# EAGLE design pot-boardB (EAGLE 6.6.0)
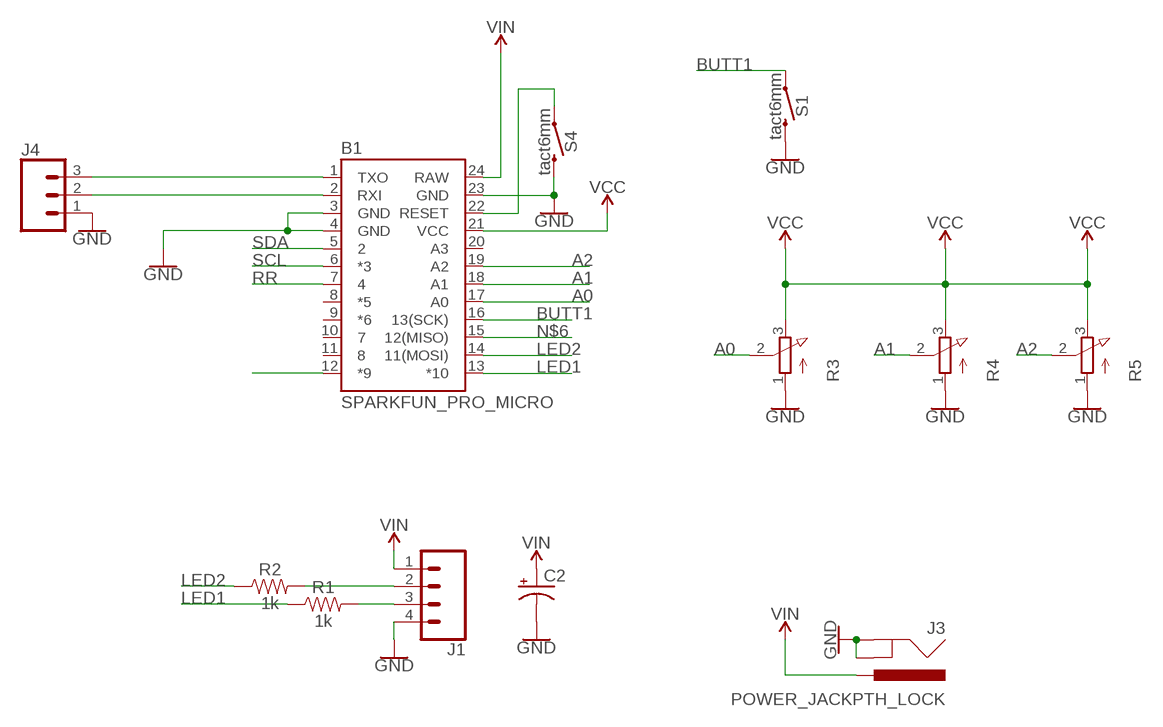
[diagram p0: schematic, sheet 1]

## Parts
B1  SPARKFUN_PRO_MICRO  [SPARKFUN_PRO_MICRO]
C2  CPOL-USE3.5-8  [E3,5-8]
J1  CONN_04  [1X04]
J3  POWER_JACKPTH_LOCK  [POWER_JACK_PTH_LOCK]
J4  CONN_03  [1X03]
R1  1k  1KOHM-HORIZ-1/4W-5%  [AXIAL-0.3]
R2  1k  1KOHM-HORIZ-1/4W-5%  [AXIAL-0.3]
R3  3RP/1610N  [3RP/1610N]
R4  3RP/1610N  [3RP/1610N]
R5  3RP/1610N  [3RP/1610N]
S1  tact6mm  MOMENTARY-SWITCH-SPST-PTH-6.0MM  [TACTILE_SWITCH_PTH_6.0MM]
S4  tact6mm  MOMENTARY-SWITCH-SPST-PTH-6.0MM  [TACTILE_SWITCH_PTH_6.0MM]

## Nets
A0: B1.17(A0) R3.2(S)
A1: B1.18(A1) R4.2(S)
A2: B1.19(A2) R5.2(S)
BUTT1: B1.16(13(SCK)) S1.1
GND: B1.3(GND) B1.4(GND) B1.23(GND) C2.- J1.4 J3.GND J3.GNDBREAK J4.1 R3.1(A) R4.1(A) R5.1(A) S1.3 S4.3
LED1: B1.13(*10) R1.P$1
LED2: B1.14(11(MOSI)) R2.P$1
N$1: J1.3 R1.P$2
N$2: J1.2 R2.P$2
N$3: B1.2(RXI) J4.2
N$4: B1.1(TXO) J4.3
N$5: B1.12(*9)
N$6: B1.15(12(MISO))
RESET: B1.22(RESET) S4.1
RR: B1.7
SCL: B1.6(*3)
SDA: B1.5
VCC: B1.21(VCC) R3.3(E) R4.3(E) R5.3(E)
VIN: B1.24(RAW) C2.+ J1.1 J3.PWR
Unconnected: B1.8(*5) B1.9(*6) B1.10 B1.11 B1.20(A3)

## Library data of the parts
B1 = SparkFun-Boards:SPARKFUN_PRO_MICRO: SparkFun Pro Micro Atmega32U4 compatible footprint. SparkFun Products: 3.3V/8MHz <https://www.sparkfun.com/products/12587> 5V/16MHz <https://www.sparkfun.com/products/12640>
C2 = adafruit:CPOL-US: POLARIZED CAPACITOR, American symbol
J1 = SparkFun-Connectors:CONN_04: Multi connection point. Often used as Generic Header-pin footprint for 0.1 inch spaced/style header connections On any of the 0.1 inch spaced packages, you can populate with these: Break Away Headers - Straight <https://www.sparkfun.com/products/116> (PRT-00116) Break Away Male Headers - Right Angle <https://www.sparkfun.com/products/553> (PRT-00553) Female Headers <https://www.sparkfun.com/products/115> (PRT-00115) Break Away Headers - Machine Pin <https://www.sparkfun.com/products/117> (PRT-00117) Break Away Female Headers - Swiss Machine Pin <https://www.sparkfun.com/products/743> (PRT-00743) For SCREWTERMINALS and SPRING TERMINALS visit here: Screw Terimnals on SparkFun.com <https://www.sparkfun.com/search/results?term=Screw+Terminals> (5mm/3.5mm/2.54mm spacing) This device is also useful as a general connection point to wire up your design to another part of your project. Our various solder wires solder well into these plated through hole pads. Hook-Up Wire - Assortment (Stranded, 22 AWG) <https://www.sparkfun.com/products/11375> (PRT-11375) Hook-Up Wire - Assortment (Solid Core, 22 AWG) <https://www.sparkfun.com/products/11367> (PRT-11367) View the entire wire category on our website here <https://www.sparkfun.com/categories/141> Special notes: Molex polarized connector foot print use with SKU : PRT-08231 with associated crimp pins and housings. 1MM SMD Version SKU: PRT-10208; PROD_ID: CONN-09696
J3 = SparkFun-Connectors:POWER_JACK: Power Jack Connector This is the standard 5.5mm barrel jack for power. The PTH is the most common, proven, reliable, footprint. The Slot footprint only works if the mill layer is transmitted to the PCB fab house so be warned. Here are the connectors we sell at SparkFun: DC Barrel Power Jack/Connector <https://www.sparkfun.com/products/119> (PRT-00119) DC Barrel Power Jack/Connector (SMD) <https://www.sparkfun.com/products/12748> (PRT-12748) DC Barrel Jack Adapter - Breadboard Compatible <https://www.sparkfun.com/products/10811> (PRT-10811) It is used on this SparkFun product (and many, many others): SparkFun RedBoard - Programmed with Arduino <https://www.sparkfun.com/products/12757> (DEV-12757) Also, if you need a mating power supply or connector, please check these out: Wall Adapter Power Supply - 9VDC 650mA <https://www.sparkfun.com/products/298> (TOL-00298) DC Barrel Jack Adapter - Male <https://www.sparkfun.com/products/10287> (PRT-10287); PROD_ID: CONN-08197; SF_ID: PRT-00119
J4 = SparkFun-Connectors:CONN_03: Multi connection point. Often used as Generic Header-pin footprint for 0.1 inch spaced/style header connections On any of the 0.1 inch spaced packages, you can populate with these: Break Away Headers - Straight <https://www.sparkfun.com/products/116> (PRT-00116) Break Away Male Headers - Right Angle <https://www.sparkfun.com/products/553> (PRT-00553) Female Headers <https://www.sparkfun.com/products/115> (PRT-00115) Break Away Headers - Machine Pin <https://www.sparkfun.com/products/117> (PRT-00117) Break Away Female Headers - Swiss Machine Pin <https://www.sparkfun.com/products/743> (PRT-00743) Stackable Header - 3 Pin (Female, 0.1") <https://www.sparkfun.com/products/13875> (PRT-13875) For SCREWTERMINALS and SPRING TERMINALS visit here: Screw Terimnals on SparkFun.com <https://www.sparkfun.com/search/results?term=Screw+Terminals> (5mm/3.5mm/2.54mm spacing) This device is also useful as a general connection point to wire up your design to another part of your project. Our various solder wires solder well into these plated through hole pads. Hook-Up Wire - Assortment (Stranded, 22 AWG) <https://www.sparkfun.com/products/11375> (PRT-11375) Hook-Up Wire - Assortment (Solid Core, 22 AWG) <https://www.sparkfun.com/products/11367> (PRT-11367) View the entire wire category on our website here <https://www.sparkfun.com/categories/141> Special notes: Molex polarized connector foot print use with SKU : PRT-08232 with associated crimp pins and housings.
R1 R2 = SparkFun-Resistors:1KOHM: 1kΩ resistor A resistor is a passive two-terminal electrical component that implements electrical resistance as a circuit element. Resistors act to reduce current flow, and, at the same time, act to lower voltage levels within circuits. - Wikipedia; PROD_ID: RES-08380
R3-R5 = pot:3RP/1610N: 16mm Potentiometer one level Source: http://www.alphapotentiometers.net/html/16mm_pot_2.html
S1 S4 = SparkFun-Switches:MOMENTARY-SWITCH-SPST: Momentary Switch (Pushbutton) - SPST Normally-open (NO) SPST momentary switches (buttons, pushbuttons). Variants PTH-12MM - 12mm square, through-hole Momentary Pushbutton Switch - 12mm Square <https://www.sparkfun.com/products/9190> (COM-09190) PTH-6.0MM, PTH-6.0MM-KIT - 6.0mm square, through-hole Mini Pushbutton Switch <https://www.sparkfun.com/products/97> (COM-00097) KIT package intended for soldering kit's - only one side of pads' copper is exposed. PTH-RIGHT-ANGLE-KIT - Right-angle, through-hole Right Angle Tactile Button <https://www.sparkfun.com/products/10791> - Used on SparkFun BigTime Watch Kit <https://www.sparkfun.com/products/11734> SMD-12MM - 12mm square, surface-mount Tactile Button - SMD (12mm) <https://www.sparkfun.com/products/12993> (COM-12993) Used on SparkFun PicoBoard <https://www.sparkfun.com/products/11888> SMD-4.5MM - 4.5mm Square Trackball Switch Used on SparkFun Blackberry Trackballer Breakout <https://www.sparkfun.com/products/13169> SMD-4.6MMX2.8MM - 4.60mm x 2.80mm, surface mount Used on SparkFun SAMD21 Mini Breakout <https://www.sparkfun.com/products/13664> SMD-5.2MM, SMD-5.2-REDUNDANT - 5.2mm square, surface-mount Mini Pushbutton Switch - SMD <https://www.sparkfun.com/products/8720> (COM-08720) Used on Arduino Pro Mini <https://www.sparkfun.com/products/11114> REDUNDANT package connects both switch circuits together SMD-6.0X3.5MM - 6.0 x 3.5mm, surface mount Momentary Reset Switch SMD <https://www.sparkfun.com/products/8229> (COM-08229) SMD-6.2MM-TALL - 6.2mm square, surface mount Tactile Button - SMD (6mm) <https://www.sparkfun.com/products/12992> Used on SparkFun Digital Sandbox <https://www.sparkfun.com/products/12651> SMD-RIGHT-ANGLE - Right-angle, surface mount Used on SparkFun Block for Intel® Edison - Arduino <https://www.sparkfun.com/products/13036>; PROD_ID: SWCH-08441; SF_SKU: COM-00097

## Board
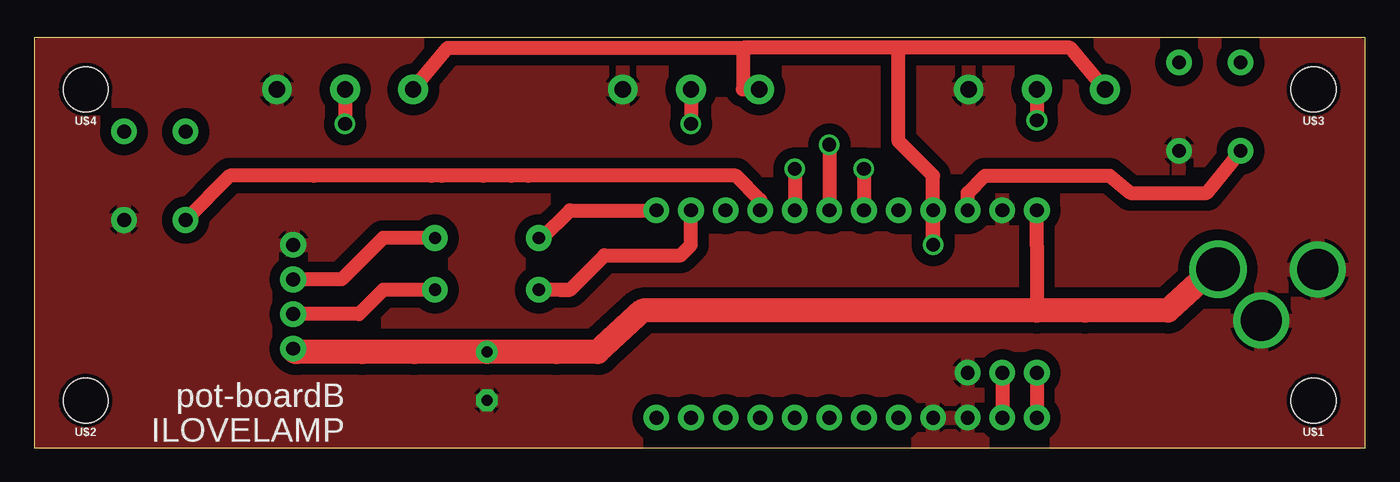
[diagram p1: board, top side]
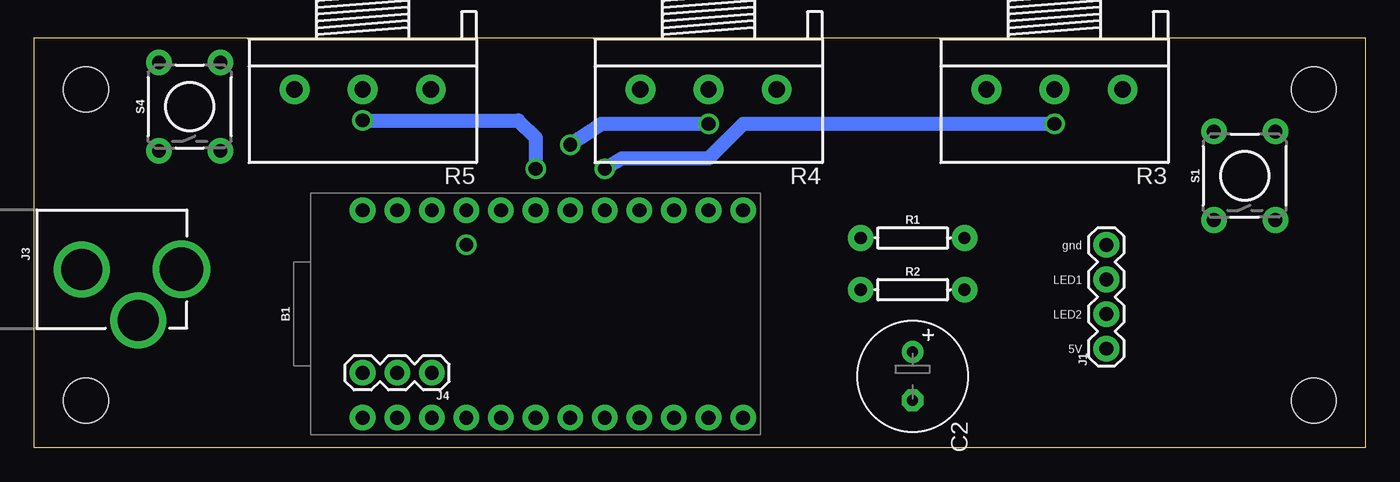
[diagram p2: board, bottom side, seen from below]

Size 97.77 x 30.15 mm. Coordinates in mm from the lower left corner, seen from the top.
Outline: 97.77,30.15 0,30.15 0,0 97.77,0 97.77,30.15
Copper layers (1*16): Top 0.035mm / dielectric 1.5mm / Bottom 0.035mm
Design rules "OthermillDRC_1_32_v2": minimum track width 8mil, minimum drill 0.8mm, track to track 0.794003125mm, track to pad 0.794003125mm, pad to pad 0.794003125mm, via to via 0.794003125mm, smd to smd 0mil, copper to edge 0mil, drill to drill 1mil, minimum pad ring 10mil, minimum via ring 10mil, stop-mask expansion 1mil, vias tented up to drill 30mil, thermal gap 10mil

### Footprints (pad centres in the part's own frame; a part is rotated, then mirrored left to right if it is on the bottom)
SPARKFUN_PRO_MICRO = drill 1.016 pad 1.88: 1 -7.62,12.7; 2 -7.62,10.16; 3 -7.62,7.62; 4 -7.62,5.08; 5 -7.62,2.54; 6 -7.62,0; 7 -7.62,-2.54; 8 -7.62,-5.08; 9 -7.62,-7.62; 10 -7.62,-10.16; 11 -7.62,-12.7; 12 -7.62,-15.24; 13 7.62,-15.24; 14 7.62,-12.7; 15 7.62,-10.16; 16 7.62,-7.62; 17 7.62,-5.08; 18 7.62,-2.54; 19 7.62,0; 20 7.62,2.54; 21 7.62,5.08; 22 7.62,7.62; 23 7.62,10.16; 24 7.62,12.7
E3,5-8 = drill 0.813 pad 1.6: + -1.778,0 | drill 0.813 pad 1.6 octagon: - 1.778,0
1X04 = drill 1.016 pad 1.88: 1 0,0; 2 2.54,0; 3 5.08,0; 4 7.62,0
POWER_JACK_PTH_LOCK = drill 2.997 pad 4.115: GND 0.025,6.557; GNDBREAK 3.762,10.7 | drill 3.2 pad 4.115: PWR 0,13.878
1X03 = drill 1.016 pad 1.88: 1 0,0; 2 2.54,0; 3 5.08,0
AXIAL-0.3 = drill 0.9 pad 1.88: P$1 -3.81,0; P$2 3.81,0
3RP/1610N = drill 1.2 pad 2.184: 1 -5,0; 2 0,0; 3 5,0
TACTILE_SWITCH_PTH_6.0MM = drill 1.016 pad 1.88: 1 -3.251,2.261; 2 3.251,2.261; 3 -3.251,-2.261; 4 3.251,-2.261
STAND-OFF = hole 3.302: 0,0

### Placement (x,y rotation side)
B1  60.94,9.83 90 bottom
C2  33.25,5.26 270 bottom
J1  19.03,7.29 90 bottom
J3  100.82,13.13 270 bottom
J4  68.56,5.51 180 bottom
R1  33.25,15.42 0 bottom
R2  33.25,11.61 0 bottom
R3  22.84,26.34 180 bottom
R4  48.24,26.34 180 bottom
R5  73.64,26.34 180 bottom
S1  8.87,19.99 90 bottom
S4  86.34,25.07 90 bottom
U$1  [STAND-OFF]  93.96,3.48 180 top
U$2  [STAND-OFF]  3.79,3.48 180 top
U$3  [STAND-OFF]  93.96,26.34 180 top
U$4  [STAND-OFF]  3.79,26.34 180 top

### Tracks (layer width: path | path; a pad name or v marks a point on that pad's centre or on a via)
A0  (via drill 1)
  Top 1.016: R3.2 v22.84,23.8 | v55.86,20.5 B1.17
  Bottom 1.016: v22.84,23.8 45.7,23.8 48.24,21.26 54.59,21.26 v55.86,20.5
A1  (via drill 1)
  Top 1.016: R4.2 v48.24,23.8 | v58.4,22.28 B1.18
  Bottom 1.016: v48.24,23.8 49.51,23.8 54.59,23.8 56.11,23.8 v58.4,22.28
A2  (via drill 1)
  Top 1.016: R5.2 v73.64,24.05 | v60.94,20.5 B1.19
  Bottom 1.016: v73.64,24.05 62.21,24.05 60.94,22.78 v60.94,20.5
BUTT1
  Top 1.016: B1.16 53.32,18.21 51.54,19.99 36.3,19.99 35.03,19.99 33,19.99 29.95,19.99 29.19,19.99 20.55,19.99 14.38,19.99 S1.1
GND
  pour Top: 0.49,0.43 97.26,0.43 97.26,29.64 0.49,29.64
LED1
  Top 1.016: B1.13 39.35,17.45 37.32,15.42 R1.P$1
LED2
  Top 1.016: 38.59,11.61 39.35,11.61 | 39.35,11.61 38.59,11.61 | 38.59,11.61 R2.P$1 | B1.14 48.24,14.91 47.48,14.15 41.89,14.15 39.35,11.61 | 38.59,11.61 39.35,11.61
N$1
  Top 1.016: R1.P$2 25.63,15.42 22.59,12.37 J1.3
N$2
  Top 1.016: R2.P$2 25.63,11.61 23.86,9.83 J1.2
N$3
  Top 1.016: J4.2 B1.2
N$4
  Top 1.016: J4.3 B1.1
RESET
  Top 1.016: B1.22 68.56,18.72 69.83,19.99 78.97,19.99 80.52,18.72 86.11,18.72 S4.1
VCC  (via drill 1)
  Top 1.016: R3.3 30.38,29.39 52.05,29.39 | 52.05,29.39 52.05,26.34 R4.3 | R5.3 76.1,29.39 63.48,29.39 | 63.48,29.39 52.05,29.39 | B1.21 v66.02,14.91 66.02,19.99 63.48,22.53 63.48,29.39
VIN
  Top 1.016: B1.24 73.64,14.91 73.64,10.08
  Top 1.778: 87.19,13.13 85.92,12.53 83.29,10.08 77.2,10.08 73.64,10.08 44.68,10.08 41.38,7.04 38.33,7.04 | 38.33,7.04 27.92,7.04 24.11,7.04 19.28,7.04 arc-90 J1.1 | 38.33,7.04 C2.+
  Top 2.54: J3.PWR 87.19,13.13

### Text on the board
tPlace: pot-boardB | ILOVELAMP
bPlace: gnd | LED1 | LED2 | 5V